# EAGLE schematic shield carte avant (EAGLE 9.2.1)
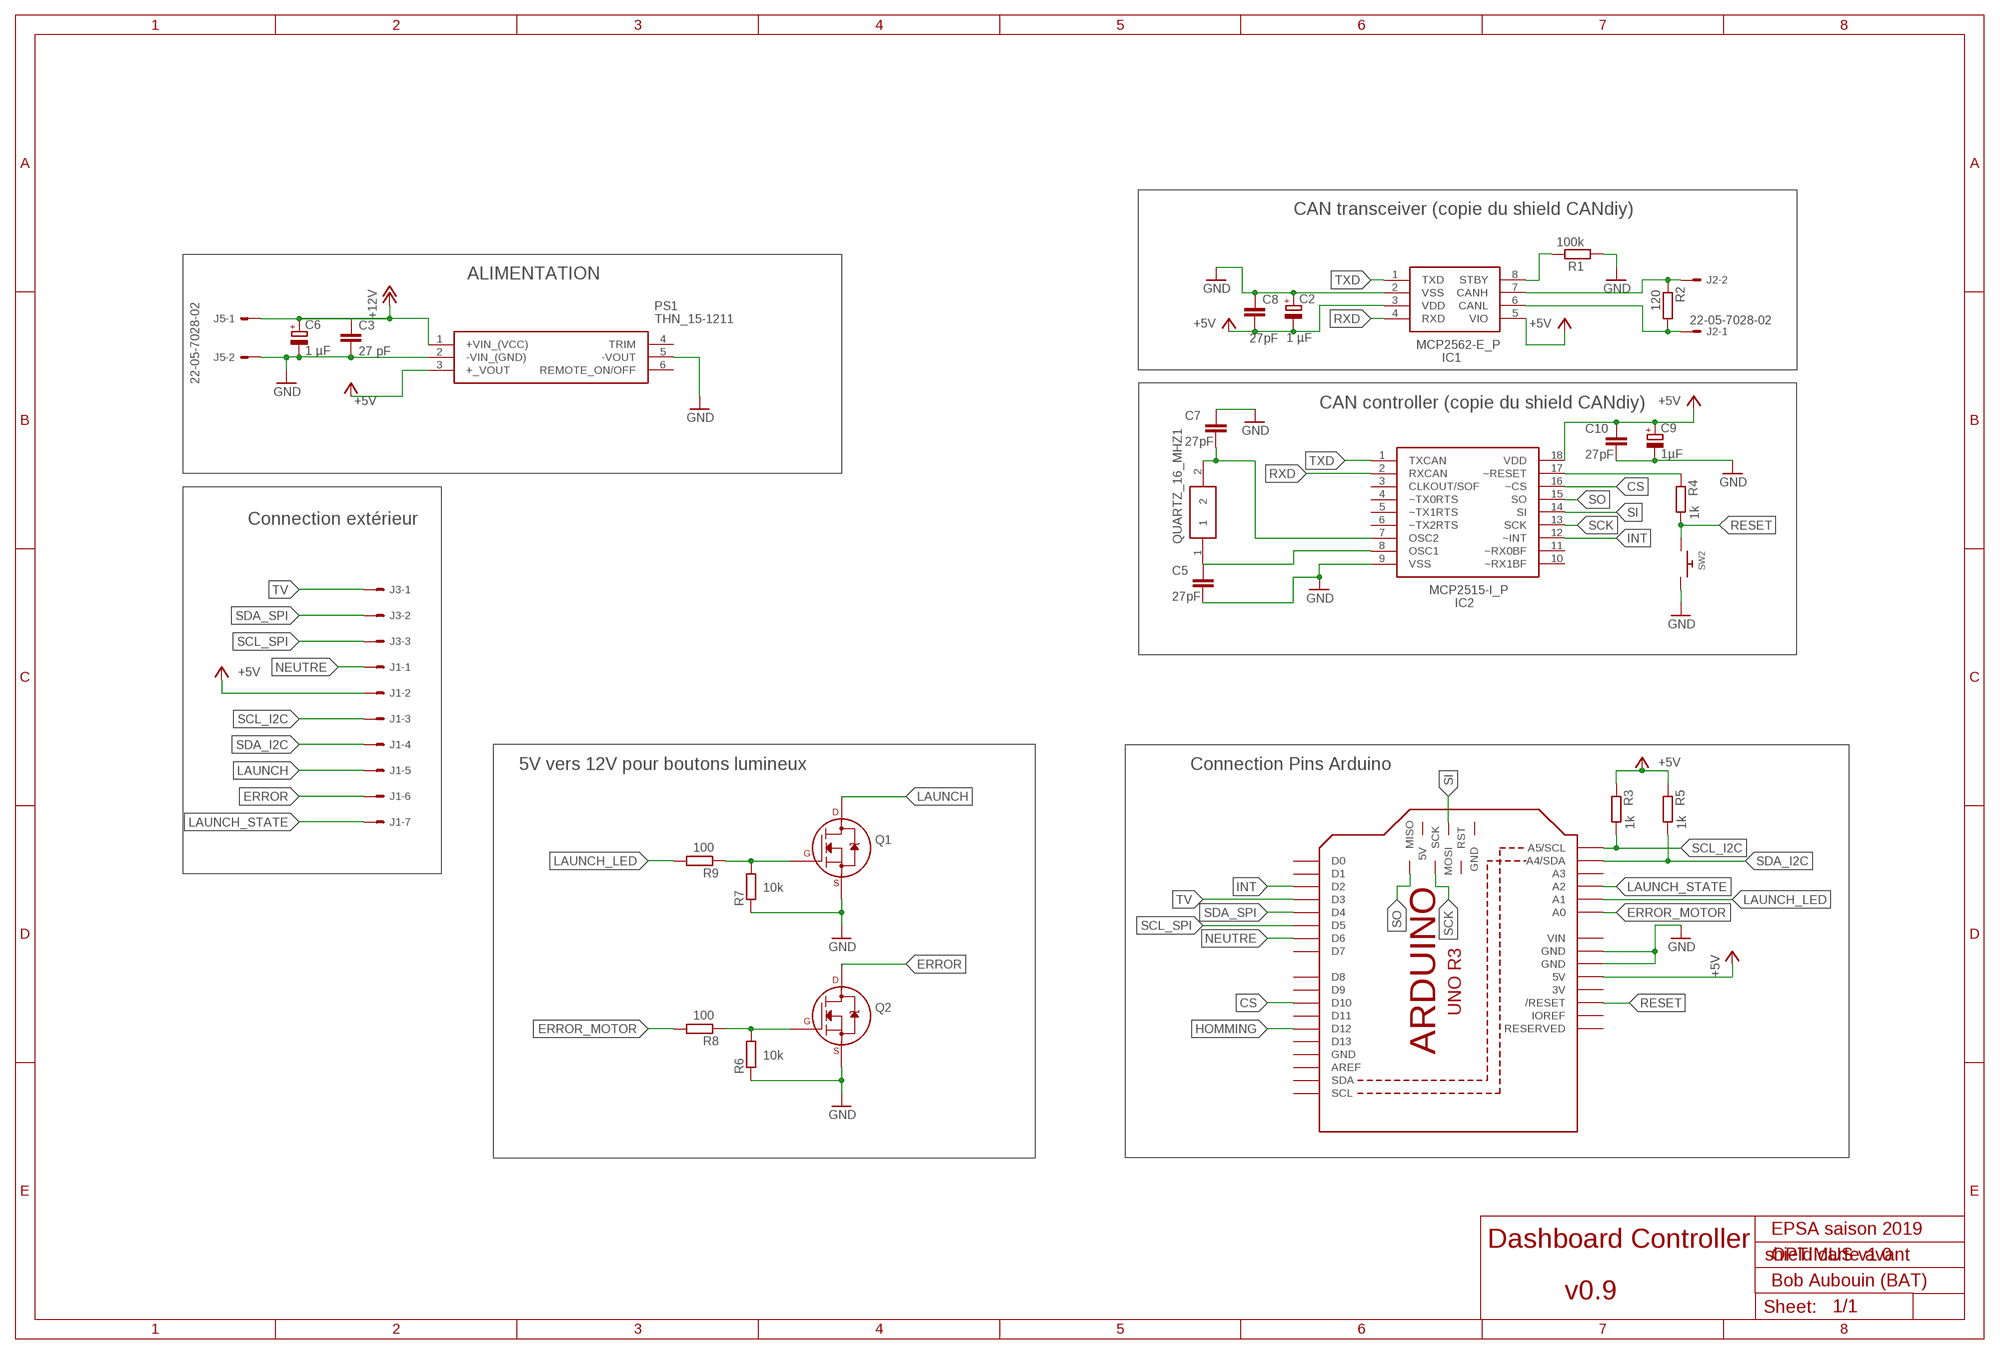
[diagram p0: schematic, sheet 1]

## Parts
C2  1 µF  CPOL-EUB45181A  [B45181A]
C3  27 pF  C-EU025-024X044  [C025-024X044]
C5  27pF  C-EU025-030X050  [C025-030X050]
C6  1 µF  CPOL-EUB45181A  [B45181A]
C7  27pF  C-EU025-030X050  [C025-030X050]
C8  27pF  C-EU025-030X050  [C025-030X050]
C9  1µF  CPOL-EUB45181A  [B45181A]
C10  27pF  C-EU025-030X050  [C025-030X050]
IC1  MCP2562-E_P  [DIP781W56P254L950H533Q8N]
IC2  MCP2515-I_P  [DIP254P762X432-18]
J1  22-05-7078-07  [7395-07]
J2  22-05-7028-02  [7395-02]
J3  22-05-7038-03  [7395-03]
J5  22-05-7028-02  [7395-02]
M1  ARDUINO_R3_ICSP  [ARDUINOR3_ICSP]
PS1  THN_15-1211  [THN-15-SERIES]
Q1  2N7000_TO92  [TO-92]
Q2  2N7000_TO92  [TO-92]
QUARTZ_16_MHZ1  FOXSLF_160-20  [HC49SLF_1]
R1  100k  R-EU_0204/7  [0204/7]
R2  120  R-EU_0204/7  [0204/7]
R3  1k  R-EU_0204/7  [0204/7]
R4  1k  R-EU_0204/7  [0204/7]
R5  1k  R-EU_0204/7  [0204/7]
R6  10k  R-EU_0204/7  [0204/7]
R7  10k  R-EU_0204/7  [0204/7]
R8  100  R-EU_0204/7  [0204/7]
R9  100  R-EU_0204/7  [0204/7]
SW2  SWITCH_PUSHBUTTONEVQ-PE  [TACT_PANA-EVQ]

## Nets
+5V: C2.- C8.2 C9.+ C10.1 IC1.3(VDD) IC2.18(VDD) J1.2 M1.5V PS1.3(+_VOUT) R3.1 R5.1
+12V: C3.1 C6.+ J5.1 PS1.1(+VIN_(VCC))
CS: IC2.16(~CS) M1.D10
ERROR: J1.6 Q2.3(D)
ERROR_MOTOR: M1.A0 R8.2
GND: C2.+ C3.2 C5.2 C6.- C7.1 C8.1 C9.- C10.2 IC1.2(VSS) IC2.9(VSS) J5.2 M1.GND@1(GND) M1.GND@3(GND) PS1.2(-VIN_(GND)) PS1.5(-VOUT) Q1.1(S) Q2.1(S) R1.1 R6.1 R7.1 SW2.P$2
HOMMING: M1.D12
INT: IC2.12(~INT) M1.D2
LAUNCH: J1.5 Q1.3(D)
LAUNCH_LED: M1.A1 R9.2
LAUNCH_STATE: J1.7 M1.A2
N$1: IC1.8(STBY) R1.2
N$3: C5.1 IC2.8(OSC1) QUARTZ_16_MHZ1.1
N$4: IC1.5(VIO) ; supply symbol labelled +5V
N$5: IC1.7(CANH) J2.2 R2.1
N$7: C7.2 IC2.7(OSC2) QUARTZ_16_MHZ1.2
N$8: IC1.6(CANL) J2.1 R2.2
N$11: IC2.17(~RESET) R4.1
N$12: Q2.2(G) R6.2 R8.1
N$13: Q1.2(G) R7.2 R9.1
NEUTRE: J1.1 M1.D6
RESET: M1.RESET(/RESET) R4.2 SW2.P$1
RXD: IC1.4(RXD) IC2.2(RXCAN)
SCK: IC2.13(SCK) M1.SCK
SCL_I2C: J1.3 M1.A5(A5/SCL) R3.2
SCL_SPI: J3.3 M1.D5
SDA_I2C: J1.4 M1.A4(A4/SDA) R5.2
SDA_SPI: J3.2 M1.D4
SI: IC2.14(SI) M1.MOSI
SO: IC2.15(SO) M1.MISO
TV: J3.1 M1.D3
TXD: IC1.1(TXD) IC2.1(TXCAN)
Unconnected: IC2.3(CLKOUT/SOF) IC2.4(~TX0RTS) IC2.5(~TX1RTS) IC2.6(~TX2RTS) IC2.10(~RX1BF) IC2.11(~RX0BF) M1.5V_ICSP(5V) M1.A3 M1.AREF M1.D0 M1.D1 M1.D7 M1.D8 M1.D9 M1.D11 M1.D13 M1.GND@2(GND) M1.IOREF M1.RESERVED M1.RESET_ICSP(RST) M1.SCL M1.SDA PS1.4(TRIM) PS1.6(REMOTE_ON/OFF)

## Notes on the sheet
- CAN transceiver (copie du shield CANdiy)
- ALIMENTATION
- CAN controller (copie du shield CANdiy)
- Connection extérieur
- 5V vers 12V pour boutons lumineux | Connection Pins Arduino
- EPSA saison 2019
- Dashboard Controller
- OPTIMUS v1.0
- Bob Aubouin (BAT)
- v0.9

## Power pins joined to a net without a drawn wire
3V: M1.3V
GND: M1.GND
VIN: M1.VIN

## Library data of the parts
C2 C6 C9 = rcl:CPOL-EU: POLARIZED CAPACITOR, European symbol; SPICEPREFIX: C
C3 C5 C7 C8 C10 = rcl:C-EU: CAPACITOR, European symbol; SPICEPREFIX: C
IC1 = MCP2562-E_P:MCP2562-E_P: CAN Transceiver 1Mbps 5V 125degC PDIP8 Microchip MCP2562-E/P, CAN Transceiver 1-channel IEC 61000-4-2, 8-Pin PDIP Source: Datasheet <http://uk.rs-online.com/web/p/products/1460216>; ALLIED_NUMBER: 70415106; DESCRIPTION: CAN Transceiver 1Mbps 5V 125degC PDIP8 Microchip MCP2562-E/P, CAN Transceiver 1-channel IEC 61000-4-2, 8-Pin PDIP; HEIGHT: 5.334mm; MANUFACTURER_NAME: Microchip; MANUFACTURER_PART_NUMBER: MCP2562-E/P; RS_PART_NUMBER: 1460216
IC2 = MCP2515-I_P:MCP2515-I_P: Stand-Alone CAN Controller Source: Datasheet <http://uk.rs-online.com/web/p/products/1445764>; ALLIED_NUMBER: 70045398; DESCRIPTION: Stand-Alone CAN Controller; HEIGHT: mm; MANUFACTURER_NAME: Microchip; MANUFACTURER_PART_NUMBER: MCP2515-I/P; RS_PART_NUMBER: 1445764
J1 = con-molex:22-?-07: CONNECTOR wire to board 2.54 mm (.1 inch) pitch header; MF: MOLEX; OC_FARNELL: unknown; OC_NEWARK: unknown
J2 = con-molex:22-?-02: CONNECTOR wire to board 2.54 mm (.1 inch) pitch header; MF: MOLEX; OC_FARNELL: 9731601; OC_NEWARK: unknown
J3 = con-molex:22-?-03: CONNECTOR wire to board 2.54 mm (.1 inch) pitch header; MF: MOLEX; OC_FARNELL: unknown; OC_NEWARK: unknown
J5 = EP_molex_6410_7395:22-?-02: CONNECTOR wire to board 2.54 mm (.1 inch) pitch header
M1 = adafruit:ARDUINO_R3_ICSP
PS1 = THN_15-1211:THN_15-1211: TRACOPOWER Isolated DC-DC Converter, Vin 9 18 V dc, Vout 5V dc, I/O isolation 1500V dc Source: Datasheet <http://uk.rs-online.com/web/p/products/0438272P>; DESCRIPTION: TRACOPOWER Isolated DC-DC Converter, Vin 9 18 V dc, Vout 5V dc, I/O isolation 1500V dc; HEIGHT: mm; MANUFACTURER_NAME: Traco Power; MANUFACTURER_PART_NUMBER: THN 15-1211; RS_PART_NUMBER: 0438272P
Q1 Q2 = transistors:2N700*: 2N7000, 2N7002, NDS7002A N-channel enhancement mode MOSFET
QUARTZ_16_MHZ1 = FOXSLF_160-20:FOXSLF_160-20: Crystal 16.000MHz HC49S HC-49-SLF Crystal 16MHz, ??30ppm, 2-Pin Source: Datasheet <http://uk.rs-online.com/web/p/products/1734298>; DESCRIPTION: Crystal 16.000MHz HC49S HC-49-SLF Crystal 16MHz, ??30ppm, 2-Pin; HEIGHT: mm; MANUFACTURER_NAME: Fox; MANUFACTURER_PART_NUMBER: FOXSLF/160-20; RS_PART_NUMBER: 1734298
R1-R9 = rcl:R-EU_: RESISTOR, European symbol; SPICEPREFIX: R
SW2 = adafruit:SWITCH_PUSHBUTTON: Buttons SOFTTOUCHSMD_SJ - Soft touch temporary push button (Super Junk Akihabara) Compatible with SKPMANE010 [Mouser: 688-SKPMAN] C&K_KSS = Digikey: KSS221GLFS

## Net classes
0 default: width 0.61 mm
1 Vcc12: width 1.016 mm